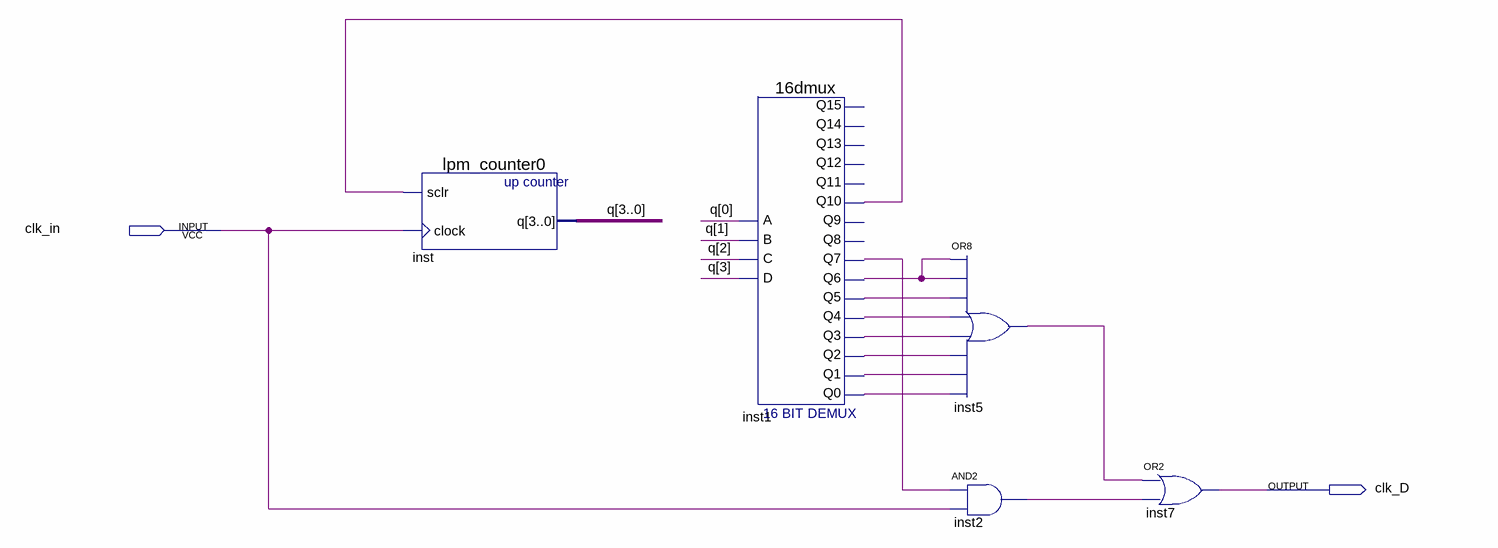
[diagram p0: schematic sheet]
// Quartus schematic lab2_block2another.bdf as structural Verilog: 5 symbols, 2 pins
module lab2_block2another (
  input  clk_in,
  output clk_D
);

  wire inst1_q0, inst1_q1, inst1_q2, inst1_q3, inst1_q4, inst1_q5, inst1_q6, inst1_q7, inst1_q10, inst2_out,
       inst5_out;
  wire [3:0] q;

  lpm_counter0 inst (.sclr(inst1_q10), .clock(clk_in), .q(q));
  \16dmux  inst1 (
    .C(q[2]), .B(q[1]), .A(q[0]), .D(q[3]), .Q10(inst1_q10), .Q7(inst1_q7), .Q4(inst1_q4), .Q5(inst1_q5),
    .Q6(inst1_q6), .Q2(inst1_q2), .Q3(inst1_q3), .Q0(inst1_q0), .Q1(inst1_q1));  // open: Q12, Q13, Q11, Q9, Q8, Q14, Q15
  or inst5 (inst5_out, inst1_q6, inst1_q6, inst1_q5, inst1_q4, inst1_q3, inst1_q2, inst1_q1, inst1_q0);
  and inst2 (inst2_out, inst1_q7, clk_in);
  or inst7 (clk_D, inst5_out, inst2_out);
endmodule
